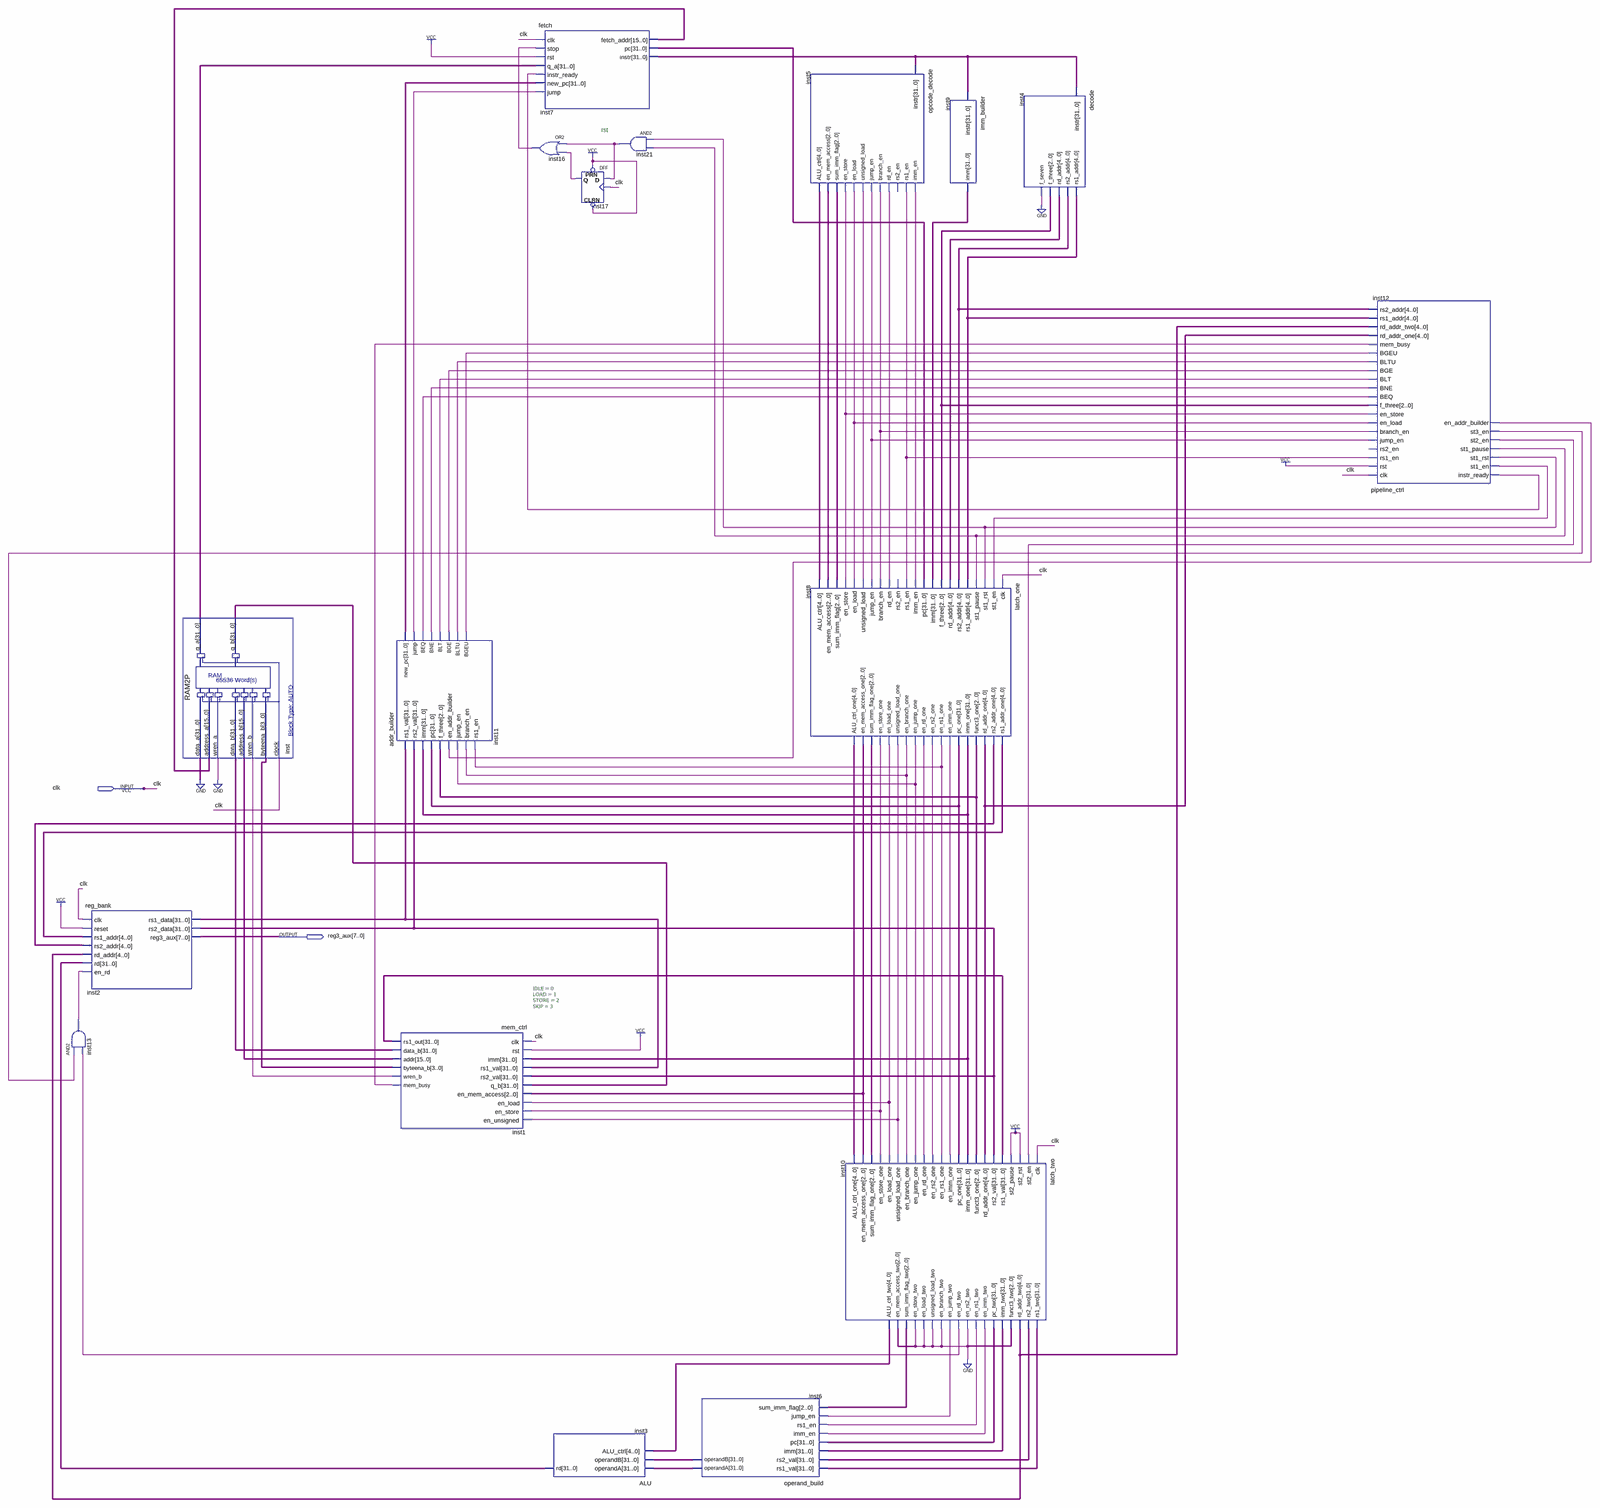
[diagram p0: schematic sheet, whole]
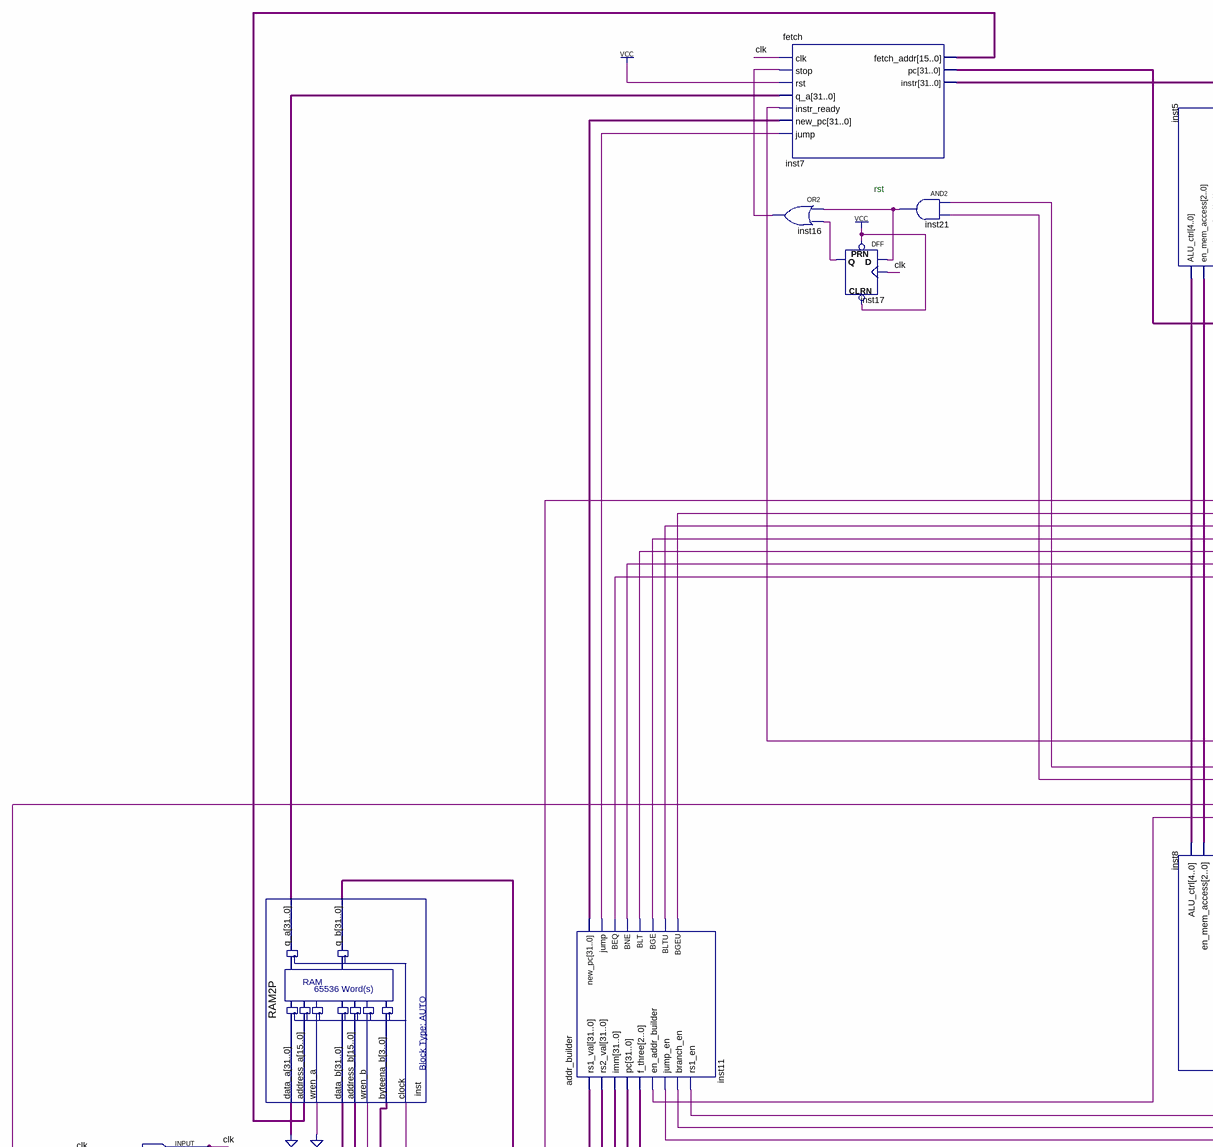
[diagram p1: schematic sheet, upper left part]
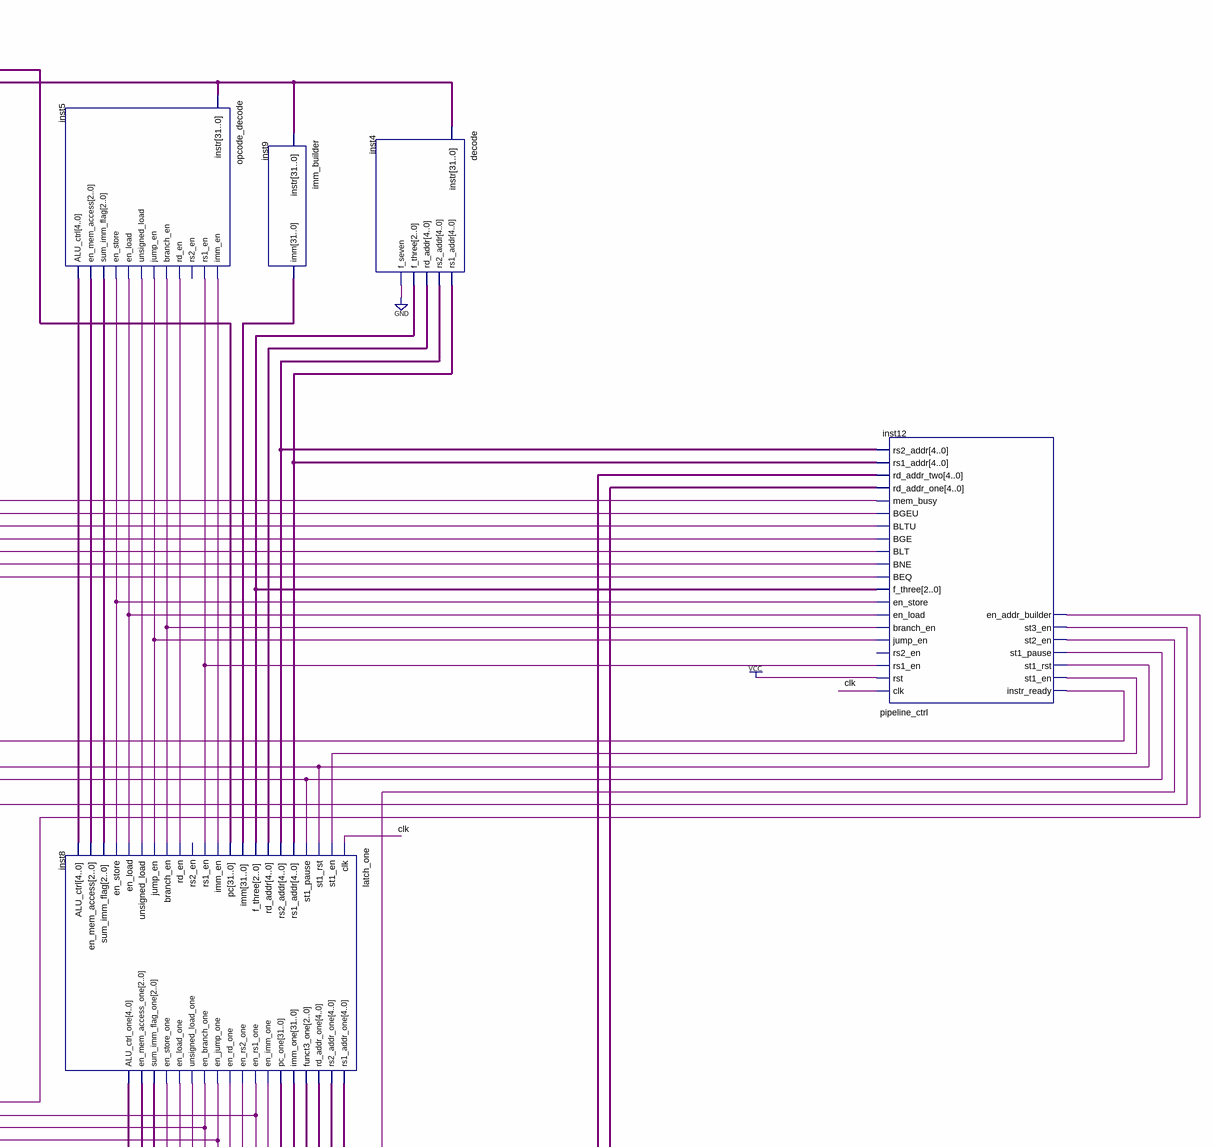
[diagram p2: schematic sheet, upper right part]
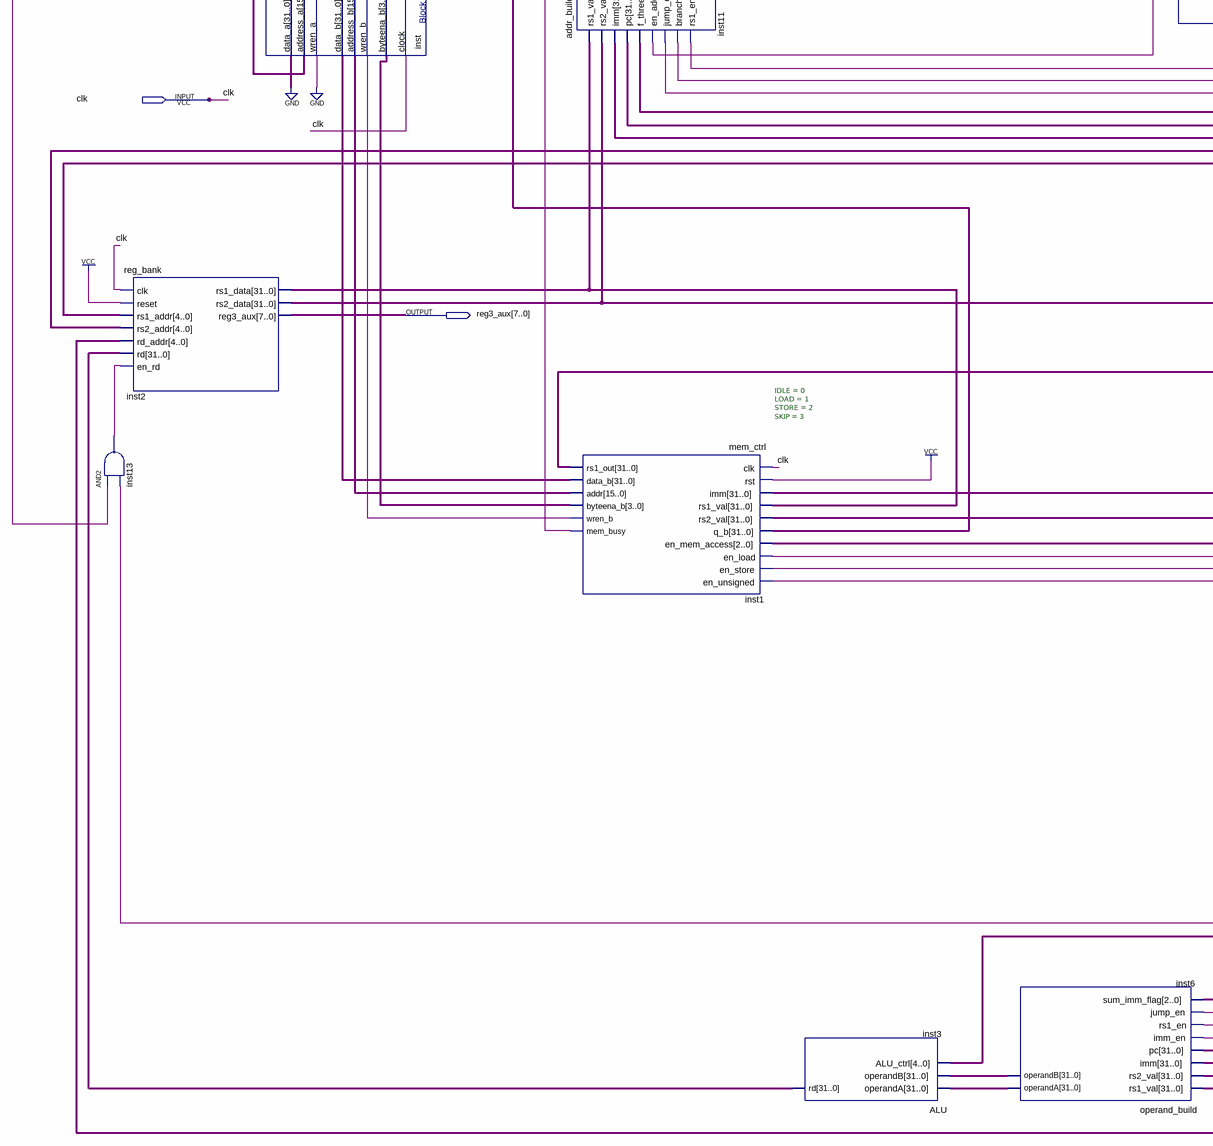
[diagram p3: schematic sheet, lower left part]
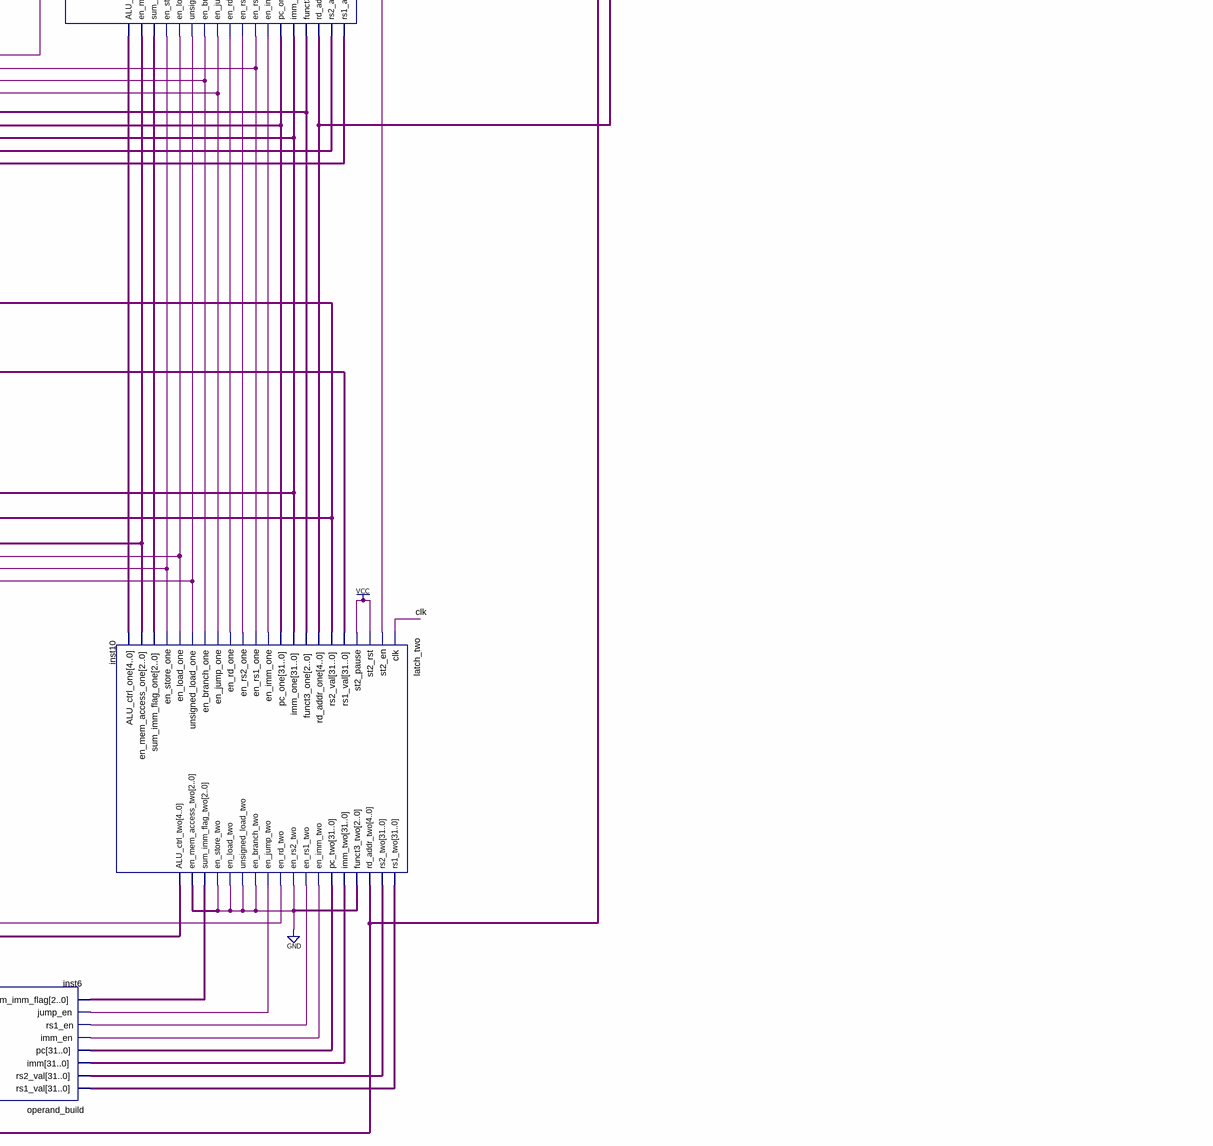
[diagram p4: schematic sheet, lower right part]
// Quartus schematic TP.bdf as structural Verilog: 17 symbols, 2 pins
module TP (
  input  clk,
  output [7:0] reg3_aux
);

  wire inst1_mem_busy, inst1_wren_b, inst4_f_seven, inst5_branch_en, inst5_en_load, inst5_en_store,
       inst5_imm_en, inst5_jump_en, inst5_rd_en, inst5_rs1_en, inst5_unsigned_load, inst8_en_branch_one,
       inst8_en_imm_one, inst8_en_jump_one, inst8_en_load_one, inst8_en_rd_one, inst8_en_rs1_one,
       inst8_en_rs2_one, inst8_en_store_one, inst8_unsigned_load_one, inst10_en_imm_two, inst10_en_jump_two,
       inst10_en_rd_two, inst10_en_rs1_two, inst10_en_rs2_two, inst11_beq, inst11_bge, inst11_bgeu,
       inst11_blt, inst11_bltu, inst11_bne, inst11_jump, inst12_en_addr_builder, inst12_instr_ready,
       inst12_st1_en, inst12_st1_pause, inst12_st1_rst, inst12_st2_en, inst12_st3_en, inst13_out, inst16_out,
       inst17_q, inst21_out;
  wire [2:0] inst4_f_three, inst5_en_mem_access, inst5_sum_imm_flag, inst8_en_mem_access_one,
       inst8_funct3_one, inst8_sum_imm_flag_one, inst10_en_mem_access_two, inst10_funct3_two,
       inst10_sum_imm_flag_two;
  wire [3:0] inst1_byteena_b;
  wire [4:0] inst4_rd_addr, inst4_rs1_addr, inst4_rs2_addr, inst5_alu_ctrl, inst8_alu_ctrl_one,
       inst8_rd_addr_one, inst8_rs1_addr_one, inst8_rs2_addr_one, inst10_alu_ctrl_two, inst10_rd_addr_two;
  wire [15:0] inst1_addr, inst7_fetch_addr;
  wire [31:0] inst1_data_b, inst1_rs1_out, inst2_rs1_data, inst2_rs2_data, inst3_rd, inst6_operanda,
       inst6_operandb, inst7_instr, inst7_pc, inst8_imm_one, inst8_pc_one, inst9_imm, inst10_imm_two,
       inst10_pc_two, inst10_rs1_two, inst10_rs2_two, inst11_new_pc, inst_q_a, inst_q_b;

  and inst13 (inst13_out, inst12_st3_en, inst10_en_rd_two);
  reg_bank inst2 (
    .clk(clk), .reset(1'b1), .rs1_addr(inst8_rs1_addr_one), .rs2_addr(inst8_rs2_addr_one),
    .rd_addr(inst10_rd_addr_two), .rd(inst3_rd), .en_rd(inst13_out), .rs1_data(inst2_rs1_data),
    .rs2_data(inst2_rs2_data), .reg3_aux(reg3_aux));
  RAM2P inst (
    .data_a({32{1'b0}}), .address_a(inst7_fetch_addr), .wren_a(1'b0), .data_b(inst1_data_b),
    .address_b(inst1_addr), .wren_b(inst1_wren_b), .byteena_b(inst1_byteena_b), .clock(clk), .q_a(inst_q_a),
    .q_b(inst_q_b));
  addr_builder inst11 (
    .rs1_val(inst2_rs1_data), .rs2_val(inst2_rs2_data), .imm(inst8_imm_one), .pc(inst8_pc_one),
    .f_three(inst8_funct3_one), .en_addr_builder(inst12_en_addr_builder), .jump_en(inst8_en_jump_one),
    .branch_en(inst8_en_branch_one), .rs1_en(inst8_en_rs1_one), .new_pc(inst11_new_pc), .jump(inst11_jump),
    .BEQ(inst11_beq), .BNE(inst11_bne), .BLT(inst11_blt), .BGE(inst11_bge), .BLTU(inst11_bltu),
    .BGEU(inst11_bgeu));
  mem_ctrl #(.IDLE(0), .LOAD(1), .STORE(2), .SKIP(3)) inst1 (
    .clk(clk), .rst(1'b1), .imm(inst8_imm_one), .rs1_val(inst2_rs1_data), .rs2_val(inst2_rs2_data),
    .q_b(inst_q_b), .en_mem_access(inst8_en_mem_access_one), .en_load(inst8_en_load_one),
    .en_store(inst8_en_store_one), .en_unsigned(inst8_unsigned_load_one), .rs1_out(inst1_rs1_out),
    .data_b(inst1_data_b), .addr(inst1_addr), .byteena_b(inst1_byteena_b), .wren_b(inst1_wren_b),
    .mem_busy(inst1_mem_busy));
  fetch inst7 (
    .clk(clk), .stop(inst16_out), .rst(1'b1), .q_a(inst_q_a), .instr_ready(inst12_instr_ready),
    .new_pc(inst11_new_pc), .jump(inst11_jump), .fetch_addr(inst7_fetch_addr), .pc(inst7_pc),
    .instr(inst7_instr));
  or inst16 (inst16_out, inst21_out, inst17_q);
  ALU inst3 (.operandA(inst6_operanda), .operandB(inst6_operandb), .ALU_ctrl(inst10_alu_ctrl_two), .rd(inst3_rd));
  DFF inst17 (.CLRN(1'b1), .CLK(clk), .D(inst21_out), .PRN(1'b1), .Q(inst17_q));
  and inst21 (inst21_out, inst12_st1_rst, inst12_st1_pause);
  operand_build inst6 (
    .rs1_val(inst10_rs1_two), .rs2_val(inst10_rs2_two), .imm(inst10_imm_two), .pc(inst10_pc_two),
    .imm_en(inst10_en_imm_two), .rs1_en(inst10_en_rs1_two), .jump_en(inst10_en_jump_two),
    .sum_imm_flag(inst10_sum_imm_flag_two), .operandA(inst6_operanda), .operandB(inst6_operandb));
  opcode_decode inst5 (
    .instr(inst7_instr), .imm_en(inst5_imm_en), .rs1_en(inst5_rs1_en), .rd_en(inst5_rd_en),
    .branch_en(inst5_branch_en), .jump_en(inst5_jump_en), .unsigned_load(inst5_unsigned_load),
    .en_load(inst5_en_load), .en_store(inst5_en_store), .sum_imm_flag(inst5_sum_imm_flag),
    .en_mem_access(inst5_en_mem_access), .ALU_ctrl(inst5_alu_ctrl));  // open: rs2_en
  latch_one inst8 (
    .clk(clk), .st1_en(inst12_st1_en), .st1_rst(inst12_st1_rst), .st1_pause(inst12_st1_pause),
    .rs1_addr(inst4_rs1_addr), .rs2_addr(inst4_rs2_addr), .rd_addr(inst4_rd_addr), .f_three(inst4_f_three),
    .imm(inst9_imm), .pc(inst7_pc), .imm_en(inst5_imm_en), .rs1_en(inst5_rs1_en), .rd_en(inst5_rd_en),
    .branch_en(inst5_branch_en), .jump_en(inst5_jump_en), .unsigned_load(inst5_unsigned_load),
    .en_load(inst5_en_load), .en_store(inst5_en_store), .sum_imm_flag(inst5_sum_imm_flag),
    .en_mem_access(inst5_en_mem_access), .ALU_ctrl(inst5_alu_ctrl), .rs1_addr_one(inst8_rs1_addr_one),
    .rs2_addr_one(inst8_rs2_addr_one), .rd_addr_one(inst8_rd_addr_one), .funct3_one(inst8_funct3_one),
    .imm_one(inst8_imm_one), .pc_one(inst8_pc_one), .en_imm_one(inst8_en_imm_one),
    .en_rs1_one(inst8_en_rs1_one), .en_rs2_one(inst8_en_rs2_one), .en_rd_one(inst8_en_rd_one),
    .en_jump_one(inst8_en_jump_one), .en_branch_one(inst8_en_branch_one),
    .unsigned_load_one(inst8_unsigned_load_one), .en_load_one(inst8_en_load_one),
    .en_store_one(inst8_en_store_one), .sum_imm_flag_one(inst8_sum_imm_flag_one),
    .en_mem_access_one(inst8_en_mem_access_one), .ALU_ctrl_one(inst8_alu_ctrl_one));  // open: rs2_en
  latch_two inst10 (
    .clk(clk), .st2_en(inst12_st2_en), .st2_rst(1'b1), .st2_pause(1'b1), .rs1_val(inst1_rs1_out),
    .rs2_val(inst2_rs2_data), .rd_addr_one(inst8_rd_addr_one), .funct3_one(inst8_funct3_one),
    .imm_one(inst8_imm_one), .pc_one(inst8_pc_one), .en_imm_one(inst8_en_imm_one),
    .en_rs1_one(inst8_en_rs1_one), .en_rs2_one(inst8_en_rs2_one), .en_rd_one(inst8_en_rd_one),
    .en_jump_one(inst8_en_jump_one), .en_branch_one(inst8_en_branch_one),
    .unsigned_load_one(inst8_unsigned_load_one), .en_load_one(inst8_en_load_one),
    .en_store_one(inst8_en_store_one), .sum_imm_flag_one(inst8_sum_imm_flag_one),
    .en_mem_access_one(inst8_en_mem_access_one), .ALU_ctrl_one(inst8_alu_ctrl_one), .rs1_two(inst10_rs1_two),
    .rs2_two(inst10_rs2_two), .rd_addr_two(inst10_rd_addr_two), .funct3_two(inst10_funct3_two),
    .imm_two(inst10_imm_two), .pc_two(inst10_pc_two), .en_imm_two(inst10_en_imm_two),
    .en_rs1_two(inst10_en_rs1_two), .en_rs2_two(inst10_en_rs2_two), .en_rd_two(inst10_en_rd_two),
    .en_jump_two(inst10_en_jump_two), .en_branch_two(inst10_en_rs2_two),
    .unsigned_load_two(inst10_en_rs2_two), .en_load_two(inst10_en_rs2_two), .en_store_two(inst10_en_rs2_two),
    .sum_imm_flag_two(inst10_sum_imm_flag_two), .en_mem_access_two(inst10_en_mem_access_two),
    .ALU_ctrl_two(inst10_alu_ctrl_two));
  imm_builder inst9 (.instr(inst7_instr), .imm(inst9_imm));
  decode inst4 (
    .instr(inst7_instr), .rs1_addr(inst4_rs1_addr), .rs2_addr(inst4_rs2_addr), .rd_addr(inst4_rd_addr),
    .f_three(inst4_f_three), .f_seven(inst4_f_seven));
  pipeline_ctrl inst12 (
    .clk(clk), .rst(1'b1), .rs1_en(inst5_rs1_en), .jump_en(inst5_jump_en), .branch_en(inst5_branch_en),
    .en_load(inst5_en_load), .en_store(inst5_en_store), .f_three(inst4_f_three), .BEQ(inst11_beq),
    .BNE(inst11_bne), .BLT(inst11_blt), .BGE(inst11_bge), .BLTU(inst11_bltu), .BGEU(inst11_bgeu),
    .mem_busy(inst1_mem_busy), .rd_addr_one(inst8_rd_addr_one), .rd_addr_two(inst10_rd_addr_two),
    .rs1_addr(inst4_rs1_addr), .rs2_addr(inst4_rs2_addr), .instr_ready(inst12_instr_ready),
    .st1_en(inst12_st1_en), .st1_rst(inst12_st1_rst), .st1_pause(inst12_st1_pause), .st2_en(inst12_st2_en),
    .st3_en(inst12_st3_en), .en_addr_builder(inst12_en_addr_builder));  // open: rs2_en
  // also tied to GND on the sheet: {inst10_en_rs2_two, inst4_f_seven}

  // Notes on the sheet:
  //   rst
endmodule
